# EAGLE schematic monitoring_board (EAGLE 9.5.1)

## Sheet 1 of 5
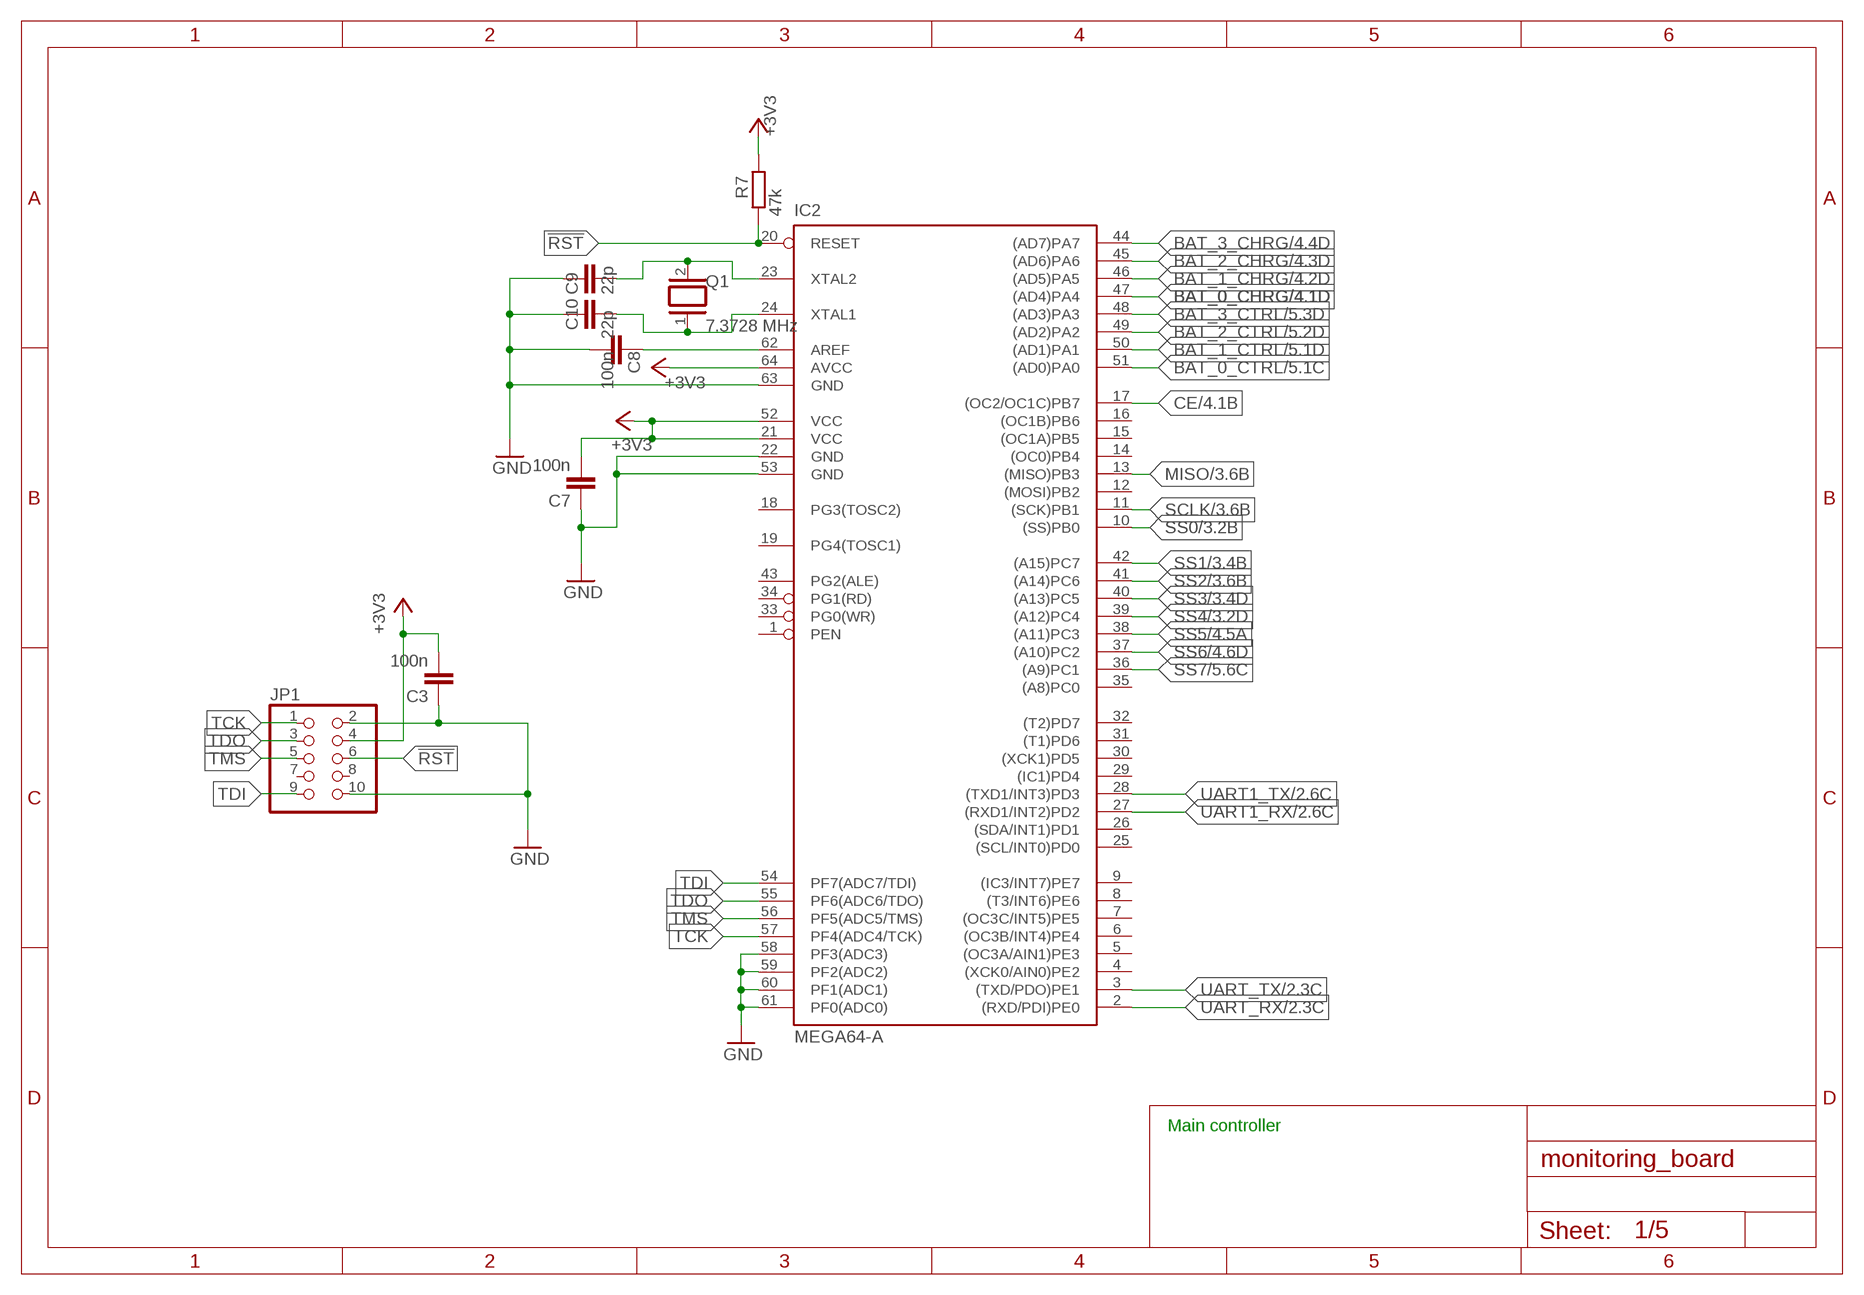
[diagram p0: schematic, sheet 1]

### Parts
C3  100n  C-EUC0603  [C0603]
C7  100n  C-EUC0603  [C0603]
C8  100n  C-EUC0603  [C0603]
C9  22p  C-EUC0603  [C0603]
C10  22p  C-EUC0603  [C0603]
IC2  MEGA64-A  [TQFP64]
JP1  PINHD-2X5  [2X05]
Q1  7.3728 MHz  XTAL/S  [QS]
R7  47k  R-EU_R0603  [R0603]

### Nets
!RST: IC2.20(RESET) JP1.6 R7.1
AREF: C8.1 IC2.62(AREF)
BAT_0_CHRG: IC2.47((AD4)PA4) ; also sheet 4
BAT_0_CTRL: IC2.51((AD0)PA0) ; also sheet 5
BAT_1_CHRG: IC2.46((AD5)PA5) ; also sheet 4
BAT_1_CTRL: IC2.50((AD1)PA1) ; also sheet 5
BAT_2_CHRG: IC2.45((AD6)PA6) ; also sheet 4
BAT_2_CTRL: IC2.49((AD2)PA2) ; also sheet 5
BAT_3_CHRG: IC2.44((AD7)PA7) ; also sheet 4
BAT_3_CTRL: IC2.48((AD3)PA3) ; also sheet 5
CE: IC2.17((OC2/OC1C)PB7) ; also sheet 4
GND: C3.1 C7.1 C8.2 C9.1 C10.1 IC2.22(GND) IC2.53(GND) IC2.58(PF3(ADC3)) IC2.59(PF2(ADC2)) IC2.60(PF1(ADC1)) IC2.61(PF0(ADC0)) IC2.63(GND) JP1.2 JP1.10 ; also sheet 2,3,4,5
MISO: IC2.13((MISO)PB3) ; also sheet 3,4,5
N$12: C9.2 IC2.23(XTAL2) Q1.2
N$13: C10.2 IC2.24(XTAL1) Q1.1
SCLK: IC2.11((SCK)PB1) ; also sheet 3,4,5
SS0: IC2.10((SS)PB0) ; also sheet 3
SS1: IC2.42((A15)PC7) ; also sheet 3
SS2: IC2.41((A14)PC6) ; also sheet 3
SS3: IC2.40((A13)PC5) ; also sheet 3
SS4: IC2.39((A12)PC4) ; also sheet 3
SS5: IC2.38((A11)PC3) ; also sheet 4
SS6: IC2.37((A10)PC2) ; also sheet 4
SS7: IC2.36((A9)PC1) ; also sheet 5
TCK: IC2.57(PF4(ADC4/TCK)) JP1.1
TDI: IC2.54(PF7(ADC7/TDI)) JP1.9
TDO: IC2.55(PF6(ADC6/TDO)) JP1.3
TMS: IC2.56(PF5(ADC5/TMS)) JP1.5
UART1_RX: IC2.27((RXD1/INT2)PD2) ; also sheet 2
UART1_TX: IC2.28((TXD1/INT3)PD3) ; also sheet 2
UART_RX: IC2.2((RXD/PDI)PE0) ; also sheet 2
UART_TX: IC2.3((TXD/PDO)PE1) ; also sheet 2
VCC3V3: C3.2 C7.2 IC2.21(VCC) IC2.52(VCC) IC2.64(AVCC) JP1.4 R7.2 ; supply symbol labelled +3V3 ; also sheet 2,3,4,5
Unconnected: IC2.1(PEN) IC2.4((XCK0/AIN0)PE2) IC2.5((OC3A/AIN1)PE3) IC2.6((OC3B/INT4)PE4) IC2.7((OC3C/INT5)PE5) IC2.8((T3/INT6)PE6) IC2.9((IC3/INT7)PE7) IC2.12((MOSI)PB2) IC2.14((OC0)PB4) IC2.15((OC1A)PB5) IC2.16((OC1B)PB6) IC2.18(PG3(TOSC2)) IC2.19(PG4(TOSC1)) IC2.25((SCL/INT0)PD0) IC2.26((SDA/INT1)PD1) IC2.29((IC1)PD4) IC2.30((XCK1)PD5) IC2.31((T1)PD6) IC2.32((T2)PD7) IC2.33(PG0(WR)) IC2.34(PG1(RD)) IC2.35((A8)PC0) IC2.43(PG2(ALE)) JP1.7 JP1.8

### Notes on the sheet
- Main controller

## Sheet 2 of 5
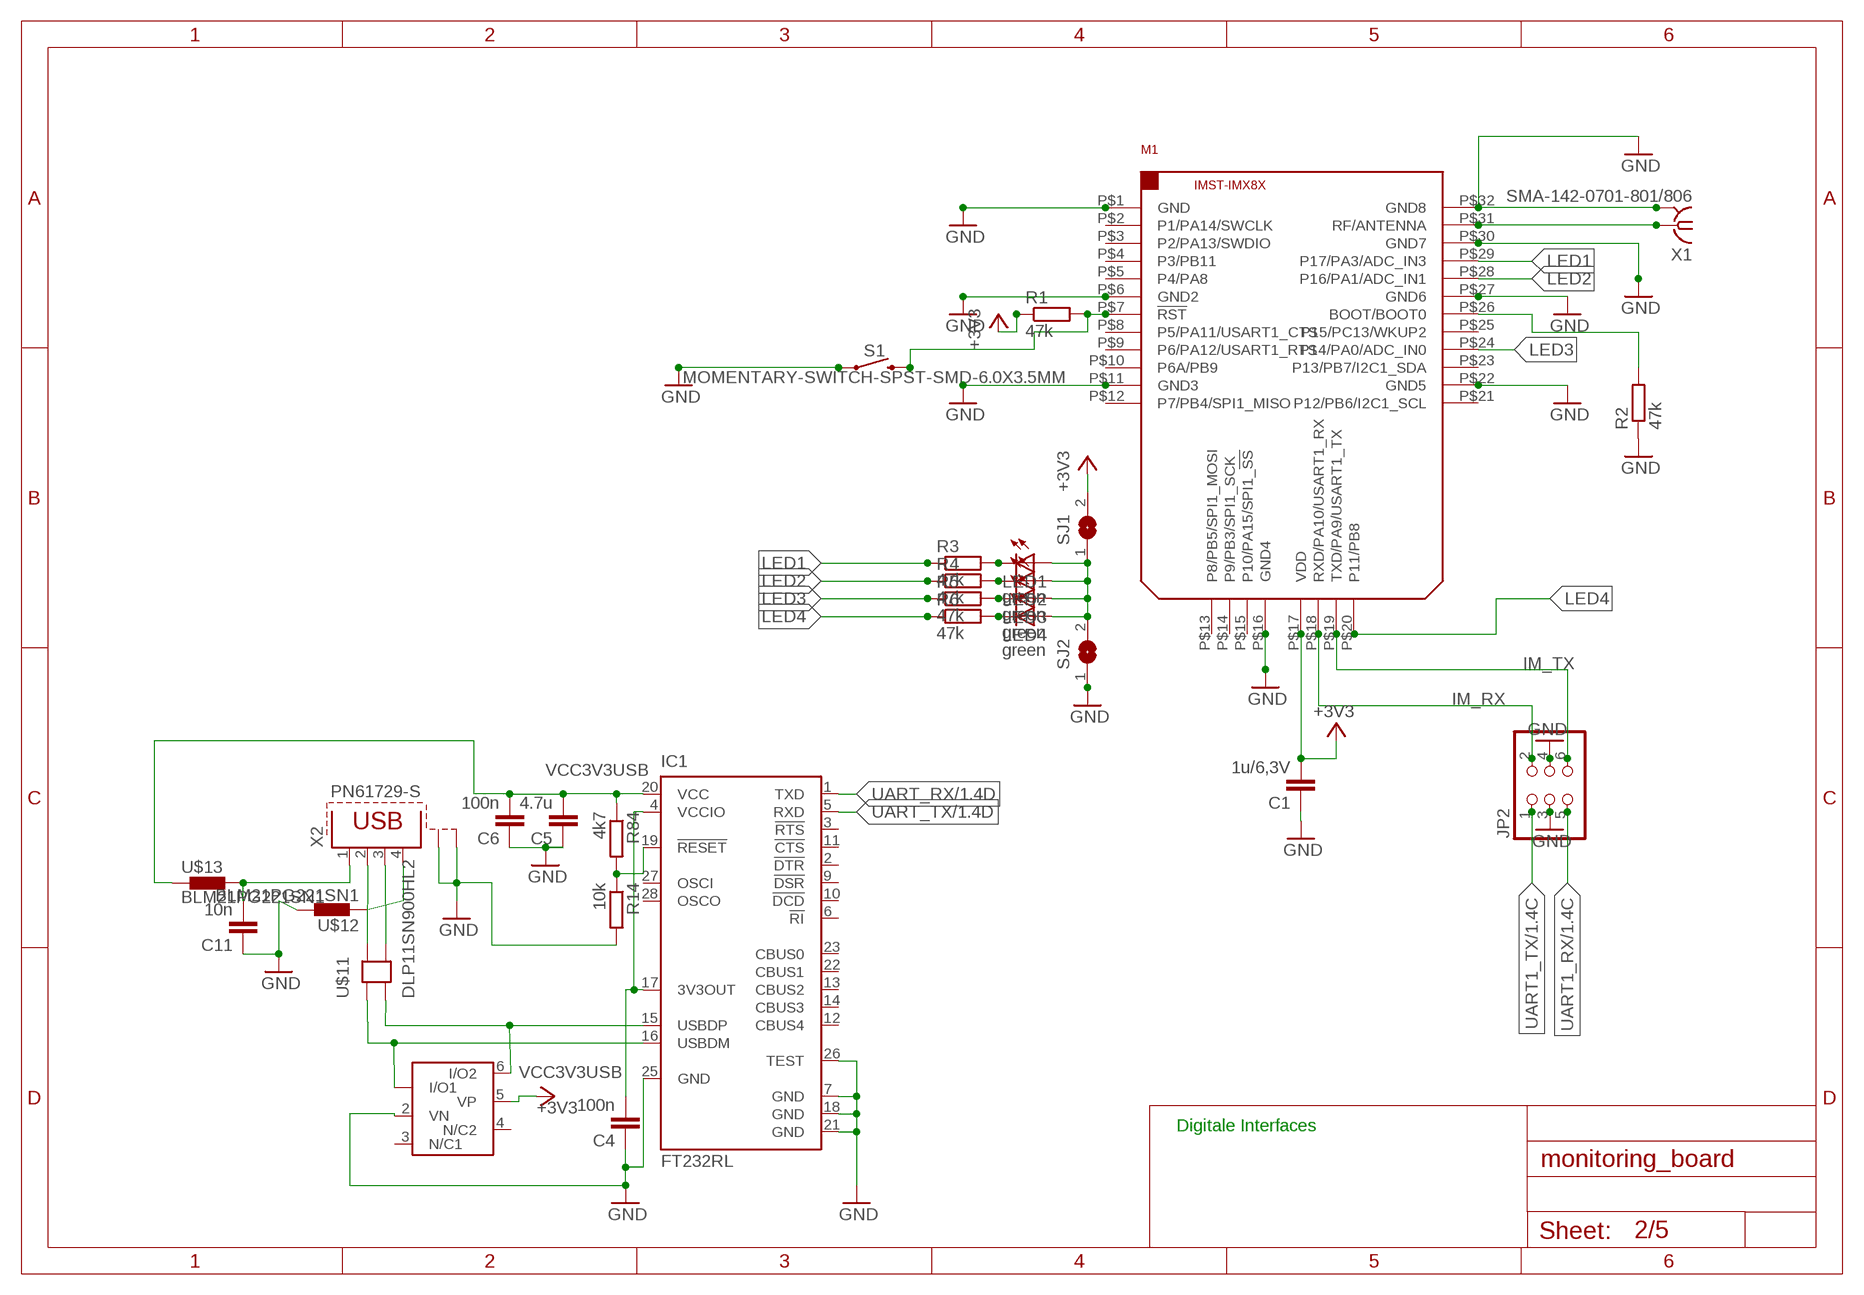
[diagram p1: schematic, sheet 2]
FRAME1 (A4L-LOC): SPICEPREFIX: X

### Parts
C1  1u/6,3V  C-EUC0603  [C0603]
C4  100n  C-EUC0603  [C0603]
C5  4.7u  C-EUC0603  [C0603]
C6  100n  C-EUC0603  [C0603]
C11  10n  C-EUC0603  [C0603]
IC1  FT232RL  [SSOP28]
JP2  PINHD-2X3  [2X03]
LED1  green  LEDCHIP-LED0603  [CHIP-LED0603]
LED2  green  LEDCHIP-LED0603  [CHIP-LED0603]
LED3  green  LEDCHIP-LED0603  [CHIP-LED0603]
LED4  green  LEDCHIP-LED0603  [CHIP-LED0603]
M1  IM-X8X  [IM-X8X]
R1  47k  R-EU_R0603  [R0603]
R2  47k  R-EU_R0603  [R0603]
R3  47k  R-EU_R0603  [R0603]
R4  47k  R-EU_R0603  [R0603]
R5  47k  R-EU_R0603  [R0603]
R6  47k  R-EU_R0603  [R0603]
R14  10k  R-EU_R0603  [R0603]
R84  4k7  R-EU_R0603  [R0603]
S1  MOMENTARY-SWITCH-SPST-SMD-6.0X3.5MM  [TACTILE_SWITCH_SMD_6.0X3.5MM]
SJ1  SJ  [SJ]
SJ2  SJ  [SJ]
U$11  DLP11SN900HL2  [DLP11SN900HL2]
U$12  BLM21PG221SN1  [BLM21PG221SN1]
U$13  BLM21PG221SN1  [BLM21PG221SN1]
U$14  DUP2201MR6  [NUP2201MR6]
X1  SMA-142-0701-801/806  [J502-ND-142-0701-801/806]
X2  PN61729-S  [PN61729-S]

### Nets
3V3OUT: C4.2 IC1.4(VCCIO) IC1.17(3V3OUT)
GND: C1.1 C4.1 C5.1 C6.1 C11.1 IC1.7(GND) IC1.18(GND) IC1.21(GND) IC1.25(GND) IC1.26(TEST) JP2.3 JP2.4 M1.P$1(GND) M1.P$6(GND2) M1.P$11(GND3) M1.P$16(GND4) M1.P$22(GND5) M1.P$27(GND6) M1.P$30(GND7) M1.P$32(GND8) R2.1 R14.2 S1.1 SJ2.1 U$12.2 U$14.2(VN) X1.G@1 X1.G@2 X1.G@3 X1.G@4 X2.S1 X2.S2 ; also sheet 1,3,4,5
IM_RX: JP2.2 M1.P$18(RXD/PA10/USART1_RX)
IM_TX: JP2.6 M1.P$19(TXD/PA9/USART1_TX)
LED1: M1.P$29(P17/PA3/ADC_IN3) R3.1
LED2: M1.P$28(P16/PA1/ADC_IN1) R4.1
LED3: M1.P$24(P14/PA0/ADC_IN0) R5.1
LED4: M1.P$20(P11/PB8) R6.1
N$1 [ant]: M1.P$31(RF/ANTENNA) X1.1
N$2: LED1.C R3.2
N$3: M1.P$7(!RST) R1.2 S1.2
N$4: M1.P$26(BOOT/BOOT0) R2.2
N$5: LED2.C R4.2
N$6: LED3.C R5.2
N$7: LED4.C R6.2
N$8: IC1.19(!RESET) R14.1 R84.2
N$9: LED1.A LED2.A LED3.A LED4.A SJ1.1 SJ2.2
N$17: U$11.2 X2.2
N$18: U$11.4 X2.3
N$19: IC1.16(USBDM) U$11.1 U$14.1(I/O1)
N$20: IC1.15(USBDP) U$11.3 U$14.6(I/O2)
N$21: U$12.1 X2.4
N$30: C11.2 U$13.2 X2.1
UART1_RX: JP2.5 ; also sheet 1
UART1_TX: JP2.1 ; also sheet 1
UART_RX: IC1.1(TXD) ; also sheet 1
UART_TX: IC1.5(RXD) ; also sheet 1
VCC3V3: C1.2 M1.P$17(VDD) R1.1 SJ1.2 ; supply symbol labelled +3V3 ; also sheet 1,3,4,5
VCC3V3USB: C5.2 C6.2 IC1.20(VCC) R84.1 U$13.1 U$14.5(VP) ; supply symbol labelled +3V3
Unconnected: IC1.2(!DTR) IC1.3(!RTS) IC1.6(!RI) IC1.9(!DSR) IC1.10(!DCD) IC1.11(!CTS) IC1.12(CBUS4) IC1.13(CBUS2) IC1.14(CBUS3) IC1.22(CBUS1) IC1.23(CBUS0) IC1.27(OSCI) IC1.28(OSCO) M1.P$2(P1/PA14/SWCLK) M1.P$3(P2/PA13/SWDIO) M1.P$4(P3/PB11) M1.P$5(P4/PA8) M1.P$8(P5/PA11/USART1_CTS) M1.P$9(P6/PA12/USART1_RTS) M1.P$10(P6A/PB9) M1.P$12(P7/PB4/SPI1_MISO) M1.P$13(P8/PB5/SPI1_MOSI) M1.P$14(P9/PB3/SPI1_SCK) M1.P$15(P10/PA15/SPI1_!SS) M1.P$21(P12/PB6/I2C1_SCL) M1.P$23(P13/PB7/I2C1_SDA) M1.P$25(P15/PC13/WKUP2) U$14.3(N/C1) U$14.4(N/C2)

### Notes on the sheet
- Digitale Interfaces

## Sheet 3 of 5
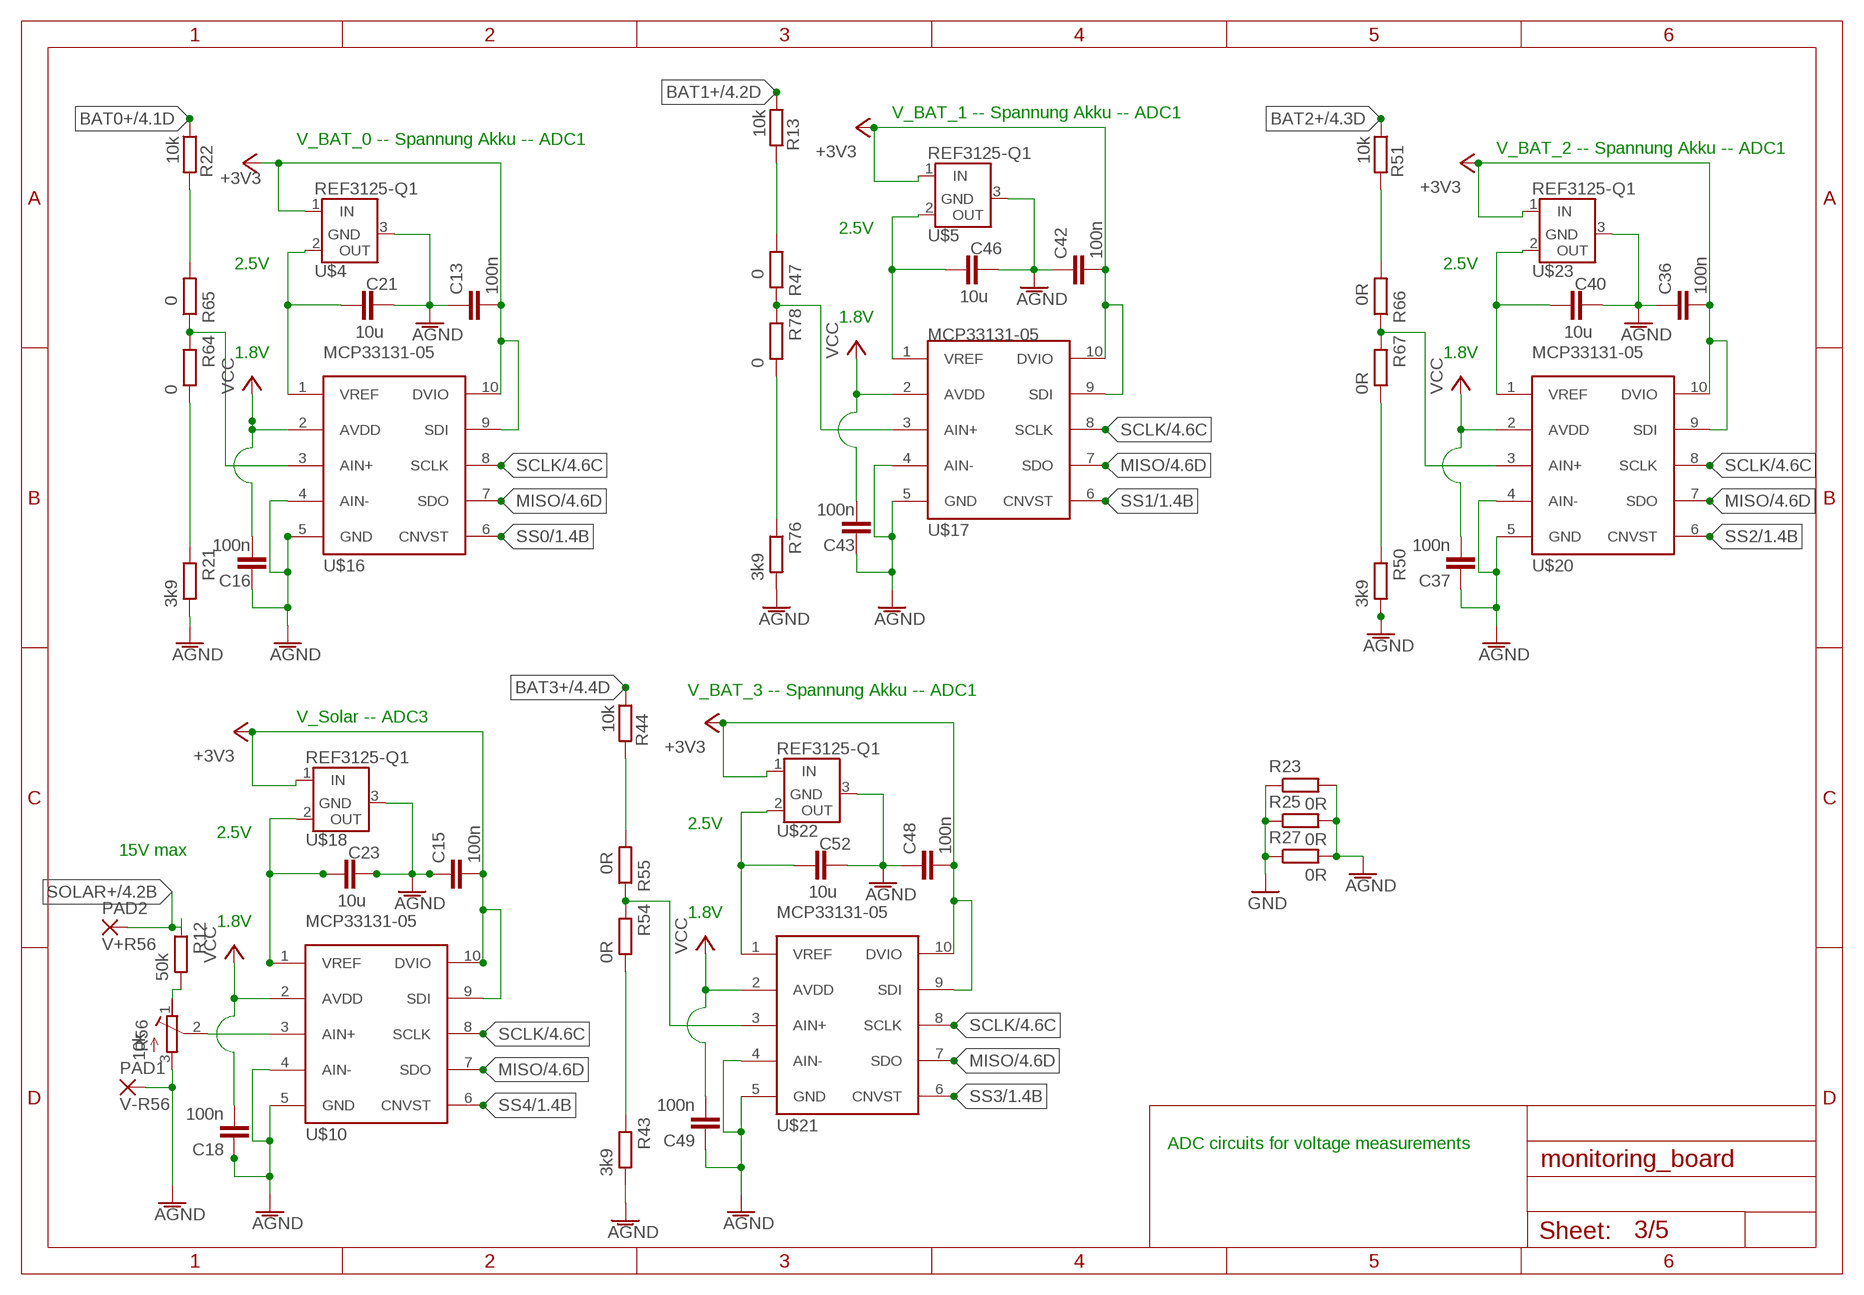
[diagram p2: schematic, sheet 3]

### Parts
C13  100n  C-EUC0603  [C0603]
C15  100n  C-EUC0603  [C0603]
C16  100n  C-EUC0603  [C0603]
C18  100n  C-EUC0603  [C0603]
C21  10u  C-EUC0603  [C0603]
C23  10u  C-EUC0603  [C0603]
C36  100n  C-EUC0603  [C0603]
C37  100n  C-EUC0603  [C0603]
C40  10u  C-EUC0603  [C0603]
C42  100n  C-EUC0603  [C0603]
C43  100n  C-EUC0603  [C0603]
C46  10u  C-EUC0603  [C0603]
C48  100n  C-EUC0603  [C0603]
C49  100n  C-EUC0603  [C0603]
C52  10u  C-EUC0603  [C0603]
PAD1  V-R56  SMD2  [SMD1,27-2,54]
PAD2  V+R56  SMD2  [SMD1,27-2,54]
R12  50k  R-EU_R0603  [R0603]
R13  10k  R-EU_R0603  [R0603]
R21  3k9  R-EU_R0603  [R0603]
R22  10k  R-EU_R0603  [R0603]
R23  0R  R-EU_R0603  [R0603]
R25  0R  R-EU_R0603  [R0603]
R27  0R  R-EU_R0603  [R0603]
R43  3k9  R-EU_R0603  [R0603]
R44  10k  R-EU_R0603  [R0603]
R47  0  R-EU_R0603  [R0603]
R50  3k9  R-EU_R0603  [R0603]
R51  10k  R-EU_R0603  [R0603]
R54  0R  R-EU_R0603  [R0603]
R55  0R  R-EU_R0603  [R0603]
R56  10k  R-TRIMM  [RTRIMCA6]
R64  0  R-EU_R0603  [R0603]
R65  0  R-EU_R0603  [R0603]
R66  0R  R-EU_R0603  [R0603]
R67  0R  R-EU_R0603  [R0603]
R76  3k9  R-EU_R0603  [R0603]
R78  0  R-EU_R0603  [R0603]
U$4  REF3125-Q1  REF31XX-Q1  [REF31XX-Q1]
U$5  REF3125-Q1  REF31XX-Q1  [REF31XX-Q1]
U$10  MCP33131-05  [MCP33131-05]
U$16  MCP33131-05  [MCP33131-05]
U$17  MCP33131-05  [MCP33131-05]
U$18  REF3125-Q1  REF31XX-Q1  [REF31XX-Q1]
U$20  MCP33131-05  [MCP33131-05]
U$21  MCP33131-05  [MCP33131-05]
U$22  REF3125-Q1  REF31XX-Q1  [REF31XX-Q1]
U$23  REF3125-Q1  REF31XX-Q1  [REF31XX-Q1]

### Nets
AGND: C13.1 C15.1 C16.1 C18.1 C21.2 C23.2 C36.1 C37.1 C40.2 C42.1 C43.1 C46.2 C48.1 C49.1 C52.2 PAD1.1(P) R21.2 R23.2 R25.2 R27.2 R43.2 R50.2 R56.3(A) R76.2 U$4.3(GND) U$5.3(GND) U$10.4(AIN-) U$10.5(GND) U$16.4(AIN-) U$16.5(GND) U$17.4(AIN-) U$17.5(GND) U$18.3(GND) U$20.4(AIN-) U$20.5(GND) U$21.4(AIN-) U$21.5(GND) U$22.3(GND) U$23.3(GND) ; also sheet 4,5
BAT0+: R22.1 ; also sheet 4,5
BAT1+: R13.1 ; also sheet 4,5
BAT2+: R51.1 ; also sheet 4,5
BAT3+: R44.1 ; also sheet 4,5
GND: R23.1 R25.1 R27.1 ; also sheet 1,2,4,5
MISO: U$10.7(SDO) U$16.7(SDO) U$17.7(SDO) U$20.7(SDO) U$21.7(SDO) ; also sheet 1,4,5
N$10: R12.2 R56.1(E)
N$22: R51.2 R66.2
N$23: C23.1 U$10.1(VREF) U$18.2(OUT)
N$24: C21.1 U$4.2(OUT) U$16.1(VREF)
N$26: R56.2(S) U$10.3(AIN+)
N$38: R22.2 R65.2
N$39: R21.1 R64.2
N$41: R13.2 R47.2
N$42: R76.1 R78.2
N$43: R50.1 R67.2
N$44: R44.2 R55.2
N$48: R43.1 R54.2
N$57: C40.1 U$20.1(VREF) U$23.2(OUT)
N$68: R64.1 R65.1 U$16.3(AIN+)
N$78: R66.1 R67.1 U$20.3(AIN+)
N$86: C46.1 U$5.2(OUT) U$17.1(VREF)
N$91: R47.1 R78.1 U$17.3(AIN+)
N$92: R54.1 R55.1 U$21.3(AIN+)
N$99: C52.1 U$21.1(VREF) U$22.2(OUT)
SCLK: U$10.8(SCLK) U$16.8(SCLK) U$17.8(SCLK) U$20.8(SCLK) U$21.8(SCLK) ; also sheet 1,4,5
SOLAR+: PAD2.1(P) R12.1 ; also sheet 4
SS0: U$16.6(CNVST) ; also sheet 1
SS1: U$17.6(CNVST) ; also sheet 1
SS2: U$20.6(CNVST) ; also sheet 1
SS3: U$21.6(CNVST) ; also sheet 1
SS4: U$10.6(CNVST) ; also sheet 1
VCC1V8: C16.2 C18.2 C37.2 C43.2 C49.2 U$10.2(AVDD) U$16.2(AVDD) U$17.2(AVDD) U$20.2(AVDD) U$21.2(AVDD) ; supply symbol labelled VCC ; also sheet 4,5
VCC3V3: C13.2 C15.2 C36.2 C42.2 C48.2 U$4.1(IN) U$5.1(IN) U$10.9(SDI) U$10.10(DVIO) U$16.9(SDI) U$16.10(DVIO) U$17.9(SDI) U$17.10(DVIO) U$18.1(IN) U$20.9(SDI) U$20.10(DVIO) U$21.9(SDI) U$21.10(DVIO) U$22.1(IN) U$23.1(IN) ; supply symbol labelled +3V3 ; also sheet 1,2,4,5

### Notes on the sheet
- V_BAT_1 -- Spannung Akku -- ADC1
- V_BAT_0 -- Spannung Akku -- ADC1
- V_BAT_2 -- Spannung Akku -- ADC1
- 2.5V
- 2.5V | 2.5V
- 1.8V
- 1.8V | 1.8V
- V_BAT_3 -- Spannung Akku -- ADC1
- V_Solar -- ADC3
- 2.5V
- 2.5V
- 15V max
- 1.8V
- 1.8V
- ADC circuits for voltage measurements

## Sheet 4 of 5
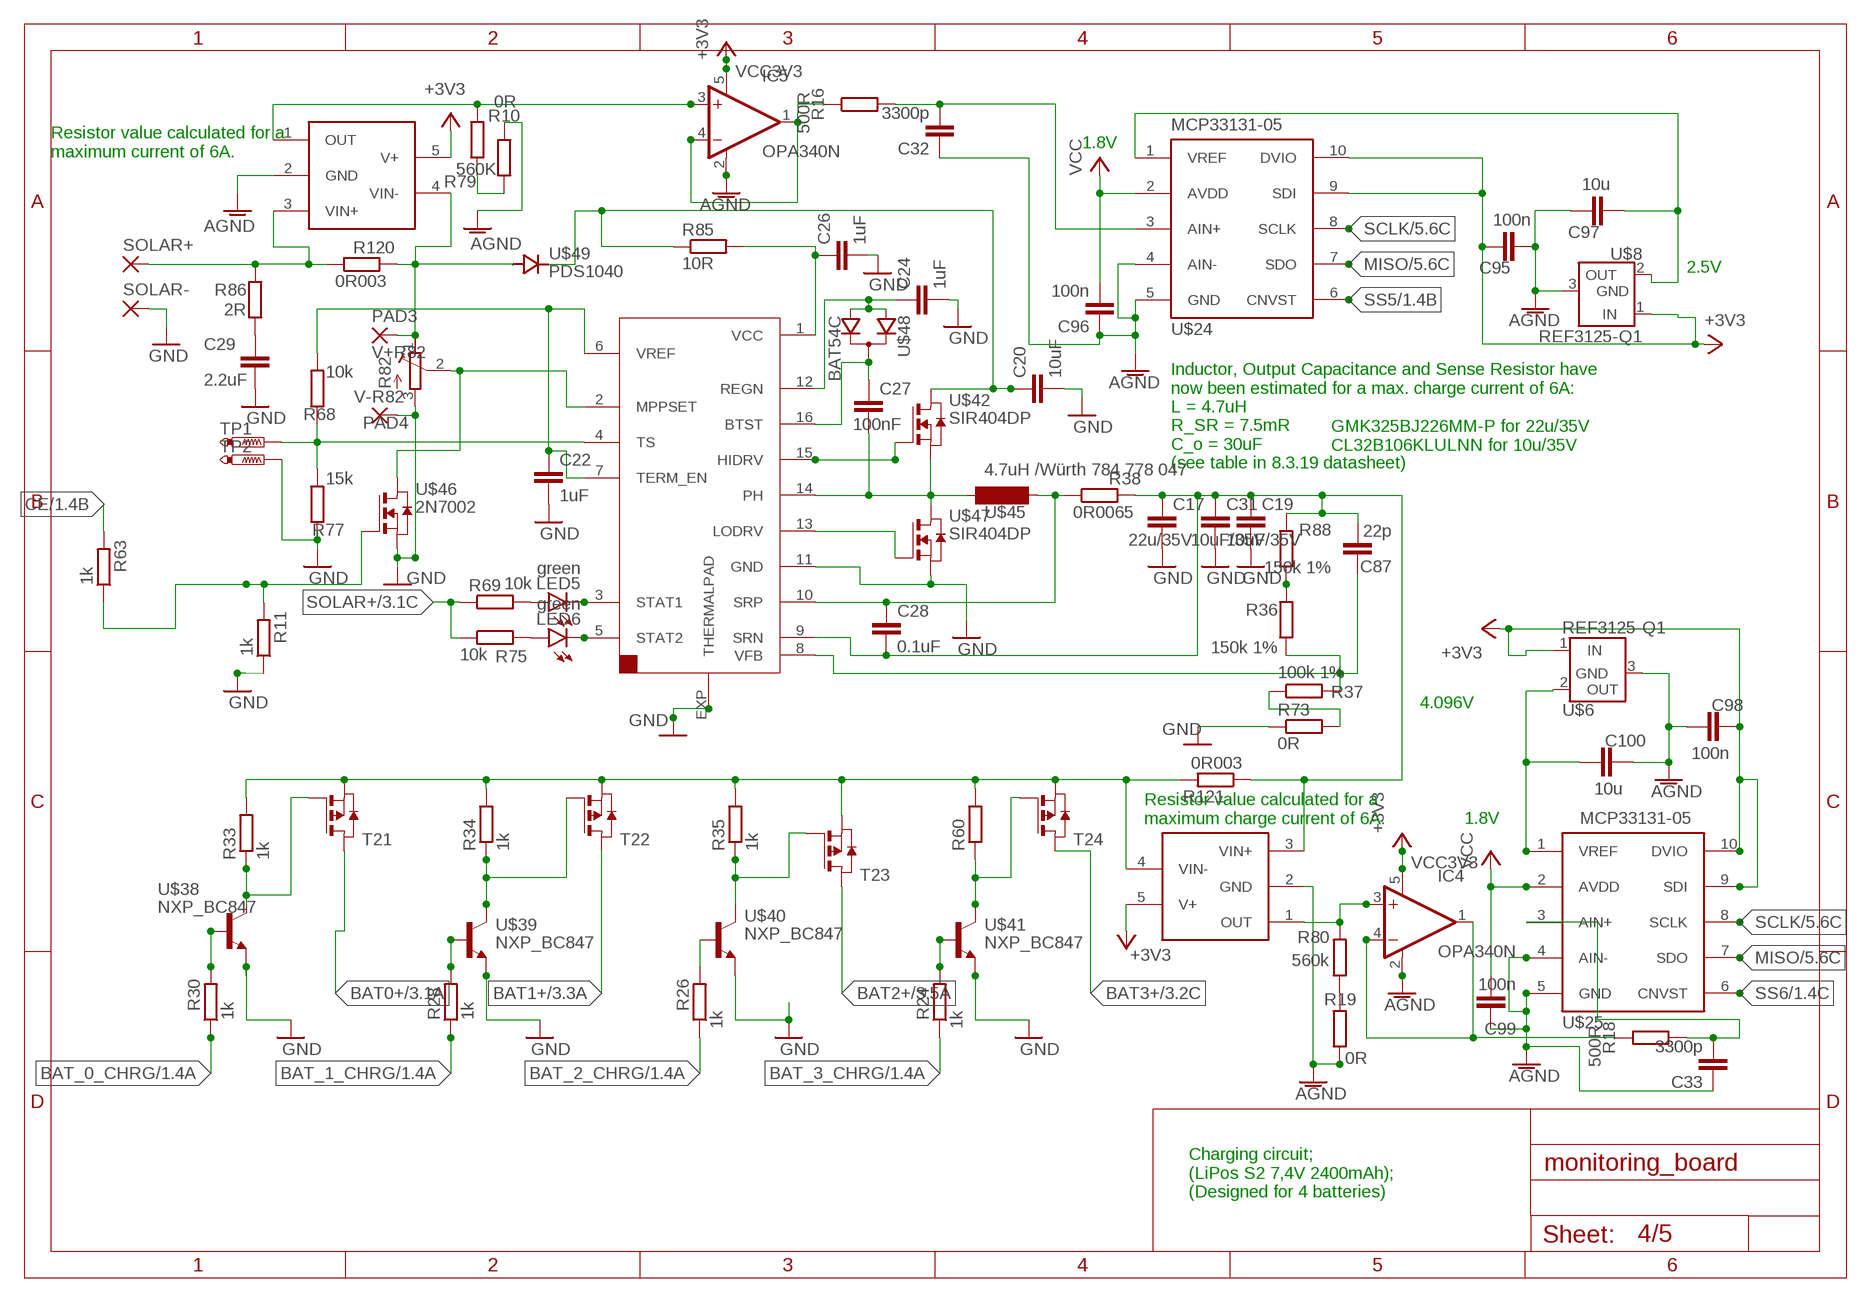
[diagram p3: schematic, sheet 4]

### Parts
C17  22u/35V  C-EUC1210  [C1210]
C19  10uF/35V  C-EUC1210  [C1210]
C20  10uF  C-EUC1210  [C1210]
C22  1uF  C-EUC0805  [C0805]
C24  1uF  C-EUC0805  [C0805]
C26  1uF  C-EUC0805  [C0805]
C27  100nF  C-EUC0805  [C0805]
C28  0.1uF  C-EUC0603K  [C0603K]
C29  2.2uF  C-EUC0805  [C0805]
C31  10uF/35V  C-EUC1210  [C1210]
C32  3300p  C-EUC0603  [C0603]
C33  3300p  C-EUC0603  [C0603]
C87  22p  C-EUC0603  [C0603]
C95  100n  C-EUC0603  [C0603]
C96  100n  C-EUC0603  [C0603]
C97  10u  C-EUC0603  [C0603]
C98  100n  C-EUC0603  [C0603]
C99  100n  C-EUC0603  [C0603]
C100  10u  C-EUC0603  [C0603]
IC4  OPA340N  [SOT23-5]
IC5  OPA340N  [SOT23-5]
LED5  green  LEDCHIPLED_0603  [CHIPLED_0603]
LED6  green  LEDCHIPLED_0603  [CHIPLED_0603]
PAD3  V+R82  SMD2  [SMD1,27-2,54]
PAD4  V-R82  SMD2  [SMD1,27-2,54]
R10  0R  R-EU_R0603  [R0603]
R11  1k  R-EU_R0603  [R0603]
R16  500R  R-EU_R0603  [R0603]
R18  500R  R-EU_R0603  [R0603]
R19  0R  R-EU_R0603  [R0603]
R24  1k  R-EU_R0603  [R0603]
R26  1k  R-EU_R0603  [R0603]
R28  1k  R-EU_R0603  [R0603]
R30  1k  R-EU_R0603  [R0603]
R33  1k  R-EU_R0603  [R0603]
R34  1k  R-EU_R0603  [R0603]
R35  1k  R-EU_R0603  [R0603]
R36  150k 1%  R-EU_R0402  [R0402]
R37  100k 1%  R-EU_R0402  [R0402]
R38  0R0065  R-EU_R2512  [R2512]
R60  1k  R-EU_R0603  [R0603]
R63  1k  R-EU_R0603  [R0603]
R68  10k  R-EU_R0402  [R0402]
R69  10k  R-EU_R0402  [R0402]
R73  0R  R-EU_R0402  [R0402]
R75  10k  R-EU_R0402  [R0402]
R77  15k  R-EU_R0402  [R0402]
R79  560K  R-EU_R0603  [R0603]
R80  560k  R-EU_R0603  [R0603]
R82  R-TRIMM  [RTRIMCA6]
R85  10R  R-EU_R1206  [R1206]
R86  2R  R-EU_R2012  [R2012]
R88  150k 1%  R-EU_R0402  [R0402]
R120  0R003  R-EU_R2512  [R2512]
R121  0R003  R-EU_R2512  [R2512]
SOLAR+  SMDPAD  [SMDPAD]
SOLAR-  SMDPAD  [SMDPAD]
T21  SI7157DP  [SI7157DP]
T22  SI7157DP  [SI7157DP]
T23  SI7157DP  [SI7157DP]
T24  SI7157DP  [SI7157DP]
TP1  PTR1PAD1-13  [P1-13]
TP2  PTR1PAD1-13  [P1-13]
U$6  REF3125-Q1  REF31XX-Q1  [REF31XX-Q1]
U$8  REF3125-Q1  REF31XX-Q1  [REF31XX-Q1]
U$24  MCP33131-05  [MCP33131-05]
U$25  MCP33131-05  [MCP33131-05]
U$27  INA138  [INA138]
U$28  INA138  [INA138]
U$36  BQ24650  [BQ24650]
U$38  NXP_BC847  [NXP_BC847]
U$39  NXP_BC847  [NXP_BC847]
U$40  NXP_BC847  [NXP_BC847]
U$41  NXP_BC847  [NXP_BC847]
U$42  SIR404DP  [SIR404DP]
U$45  4.7uH /Würth 784 778 047  IHLP-2525CZ-01  [IHLP-2525CZ-01]
U$46  2N7002  [2N7002]
U$47  SIR404DP  [SIR404DP]
U$48  BAT54C  [BAT54C]
U$49  PDS1040  [PDS1040]

### Nets
AGND: C32.1 C33.1 C95.1 C96.1 C97.2 C98.1 C99.1 C100.2 IC4.2(V-) IC5.2(V-) R10.1 R19.1 U$6.3(GND) U$8.3(GND) U$24.4(AIN-) U$24.5(GND) U$25.4(AIN-) U$25.5(GND) U$27.2(GND) U$28.2(GND) ; also sheet 3,5
AIN+: IC4.3(+IN) R80.2 U$27.1(OUT)
BAT0+: T21.5(D) T21.6(D) T21.7(D) T21.8(D) T21.9(D) ; also sheet 3,5
BAT1+: T22.5(D) T22.6(D) T22.7(D) T22.8(D) T22.9(D) ; also sheet 3,5
BAT2+: T23.5(D) T23.6(D) T23.7(D) T23.8(D) T23.9(D) ; also sheet 3,5
BAT3+: T24.5(D) T24.6(D) T24.7(D) T24.8(D) T24.9(D) ; also sheet 3,5
BAT_0_CHRG: R30.1 ; also sheet 1
BAT_1_CHRG: R28.1 ; also sheet 1
BAT_2_CHRG: R26.1 ; also sheet 1
BAT_3_CHRG: R24.1 ; also sheet 1
BTST: C27.1 U$36.16(BTST) U$48.3(C)
CE: R63.2 ; also sheet 1
GND: C17.2 C19.2 C20.2 C22.2 C24.2 C26.2 C29.2 C31.2 PAD4.1(P) R11.1 R73.1 R77.1 R82.3(A) SOLAR-.1(P) TP2.TP U$36.11(GND) U$36.EXP(THERMALPAD) U$38.2(E) U$39.2(E) U$40.2(E) U$41.2(E) U$46.2(S) U$47.1(S) U$47.2(S) U$47.3(S) ; also sheet 1,2,3,5
HIDRV: U$36.15(HIDRV) U$42.4(G)
LODRV: U$36.13(LODRV) U$47.4(G)
MISO: U$24.7(SDO) U$25.7(SDO) ; also sheet 1,3,5
MPPSET: R82.2(S) U$36.2(MPPSET) U$46.3(D)
N$25: IC4.1(OUT) IC4.4(-IN) R18.1
N$29: IC5.1(OUT) IC5.4(-IN) R16.1
N$34: R33.1 T21.4(G) U$38.3(C)
N$36: C32.2 R16.2 U$24.3(AIN+)
N$37: C33.2 R18.2 U$25.3(AIN+)
N$40: IC5.3(+IN) R79.2 U$28.1(OUT)
N$46: R34.1 T22.4(G) U$39.3(C)
N$47: LED5.A R69.2
N$51: R35.1 T23.4(G) U$40.3(C)
N$52: LED6.A R75.2
N$54: C29.1 R86.1
N$55: R10.2 R79.1
N$59: R60.1 T24.4(G) U$41.3(C)
N$61: R26.2 U$40.1(B)
N$62: R28.2 U$39.1(B)
N$63: R30.2 U$38.1(B)
N$64: R24.2 U$41.1(B)
N$65: R11.2 R63.1 U$46.1(G)
N$83: R36.2 R88.1
N$95: R19.2 R80.1
N$98: C87.1 R36.1 R37.2 U$36.8(VFB)
N$100: R37.1 R73.2
N$114: C26.1 R85.2 U$36.1(VCC)
N$154: C20.1 R85.1 U$42.5(D) U$42.6(D) U$42.7(D) U$42.8(D) U$42.9(D) U$49.P$1(C)
N$173: PAD3.1(P) R82.1(E) R120.2 U$28.4(VIN-) U$49.1(A) U$49.2(A)
N$201: C100.1 U$6.2(OUT) U$25.1(VREF)
N$202: R33.2 R34.2 R35.2 R60.2 R121.2 T21.1(S) T21.2(S) T21.3(S) T22.1(S) T22.2(S) T22.3(S) T23.1(S) T23.2(S) T23.3(S) T24.1(S) T24.2(S) T24.3(S) U$27.4(VIN-)
N$204: C97.1 U$8.2(OUT) U$24.1(VREF)
PH: C27.2 U$36.14(PH) U$42.1(S) U$42.2(S) U$42.3(S) U$45.1 U$47.5(D) U$47.6(D) U$47.7(D) U$47.8(D) U$47.9(D)
REGN: C24.1 U$36.12(REGN) U$48.1(A1) U$48.2(A2)
SCLK: U$24.8(SCLK) U$25.8(SCLK) ; also sheet 1,3,5
SOLAR+: R69.1 R75.1 R86.2 R120.1 SOLAR+.1(P) U$28.3(VIN+) ; also sheet 3
SRN: C17.1 C19.1 C28.2 C31.1 C87.2 R38.2 R88.2 R121.1 U$27.3(VIN+) U$36.9(SRN)
SRP: C28.1 R38.1 U$36.10(SRP) U$45.2
SS5: U$24.6(CNVST) ; also sheet 1
SS6: U$25.6(CNVST) ; also sheet 1
STAT1: LED5.C U$36.3(STAT1)
STAT2: LED6.C U$36.5(STAT2)
TS: R68.1 R77.2 TP1.TP U$36.4(TS)
VCC1V8: C96.2 C99.2 U$24.2(AVDD) U$25.2(AVDD) ; supply symbol labelled VCC ; also sheet 3,5
VCC3V3: C95.2 C98.2 IC4.5(V+) IC5.5(V+) U$6.1(IN) U$8.1(IN) U$24.9(SDI) U$24.10(DVIO) U$25.9(SDI) U$25.10(DVIO) U$27.5(V+) U$28.5(V+) ; supply symbol labelled +3V3 ; also sheet 1,2,3,5
VREF: C22.1 R68.2 U$36.6(VREF) U$36.7(TERM_EN)

### Notes on the sheet
- 1.8V
- Resistor value calculated for a 
  maximum current of 6A.
- 2.5V
- GMK325BJ226MM-P for 22u/35V
  CL32B106KLULNN for 10u/35V
- Inductor, Output Capacitance and Sense Resistor have
  now been estimated for a max. charge current of 6A:
  L = 4.7uH
  R_SR = 7.5mR
  C_o = 30uF
  (see table in 8.3.19 datasheet)
- 4.096V
- Resistor value calculated for a 
  maximum charge current of 6A.
- 1.8V
- Charging circuit;
  (LiPos S2 7,4V 2400mAh);
  (Designed for 4 batteries)

## Sheet 5 of 5
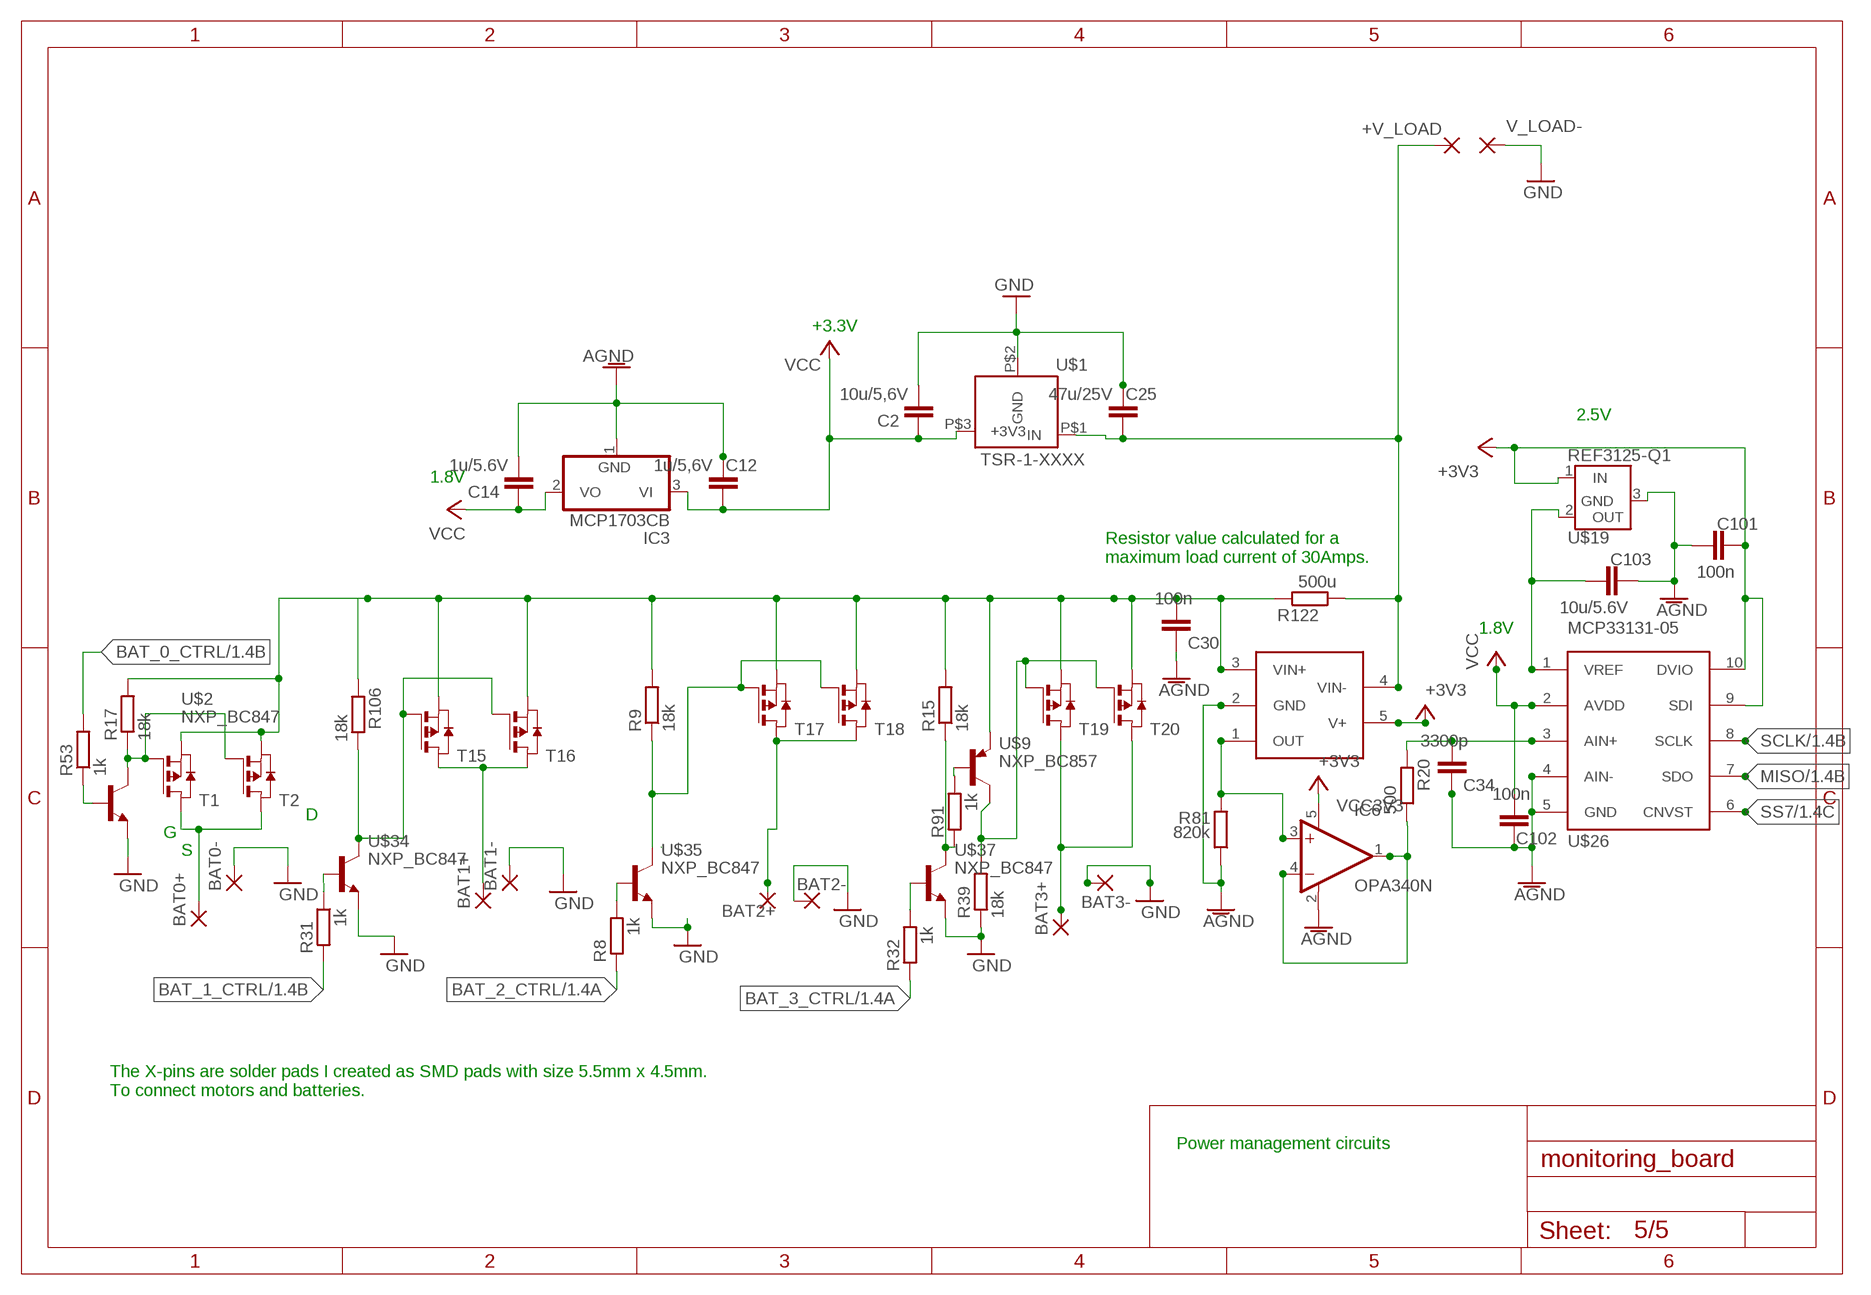
[diagram p4: schematic, sheet 5]

### Parts
+V_LOAD  SMDPAD  [SMDPAD]
BAT0+  SMDPAD  [SMDPAD]
BAT0-  SMDPAD  [SMDPAD]
BAT1+  SMDPAD  [SMDPAD]
BAT1-  SMDPAD  [SMDPAD]
BAT2+  SMDPAD  [SMDPAD]
BAT2-  SMDPAD  [SMDPAD]
BAT3+  SMDPAD  [SMDPAD]
BAT3-  SMDPAD  [SMDPAD]
C2  10u/5,6V  C-EUC1206  [C1206]
C12  1u/5,6V  C-EUC1206  [C1206]
C14  1u/5.6V  C-EUC1206  [C1206]
C25  47u/25V  C-EUC1206  [C1206]
C30  100n  C-EUC0603  [C0603]
C34  3300p  C-EUC0603  [C0603]
C101  100n  C-EUC0603  [C0603]
C102  100n  C-EUC0603  [C0603]
C103  10u/5.6V  C-EUC0603  [C0603]
IC3  MCP1703CB  [SOT23]
IC6  OPA340N  [SOT23-5]
R8  1k  R-EU_R0603  [R0603]
R9  18k  R-EU_R0603  [R0603]
R15  18k  R-EU_R0603  [R0603]
R17  18k  R-EU_R0603  [R0603]
R20  500  R-EU_R0603  [R0603]
R31  1k  R-EU_R0603  [R0603]
R32  1k  R-EU_R0603  [R0603]
R39  18k  R-EU_R0603  [R0603]
R53  1k  R-EU_R0603  [R0603]
R81  820k  R-EU_R0603  [R0603]
R91  1k  R-EU_R0603  [R0603]
R106  18k  R-EU_R0603  [R0603]
R122  500u  R-EU_R2512  [R2512]
T1  SI7157DP  [SI7157DP]
T2  SI7157DP  [SI7157DP]
T15  SI7157DP  [SI7157DP]
T16  SI7157DP  [SI7157DP]
T17  SI7157DP  [SI7157DP]
T18  SI7157DP  [SI7157DP]
T19  SI7157DP  [SI7157DP]
T20  SI7157DP  [SI7157DP]
U$1  TSR-1-XXXX  [TSR-1-XXXX]
U$2  NXP_BC847  [NXP_BC847]
U$9  NXP_BC857  [NXP_BC857]
U$19  REF3125-Q1  REF31XX-Q1  [REF31XX-Q1]
U$26  MCP33131-05  [MCP33131-05]
U$29  INA138  [INA138]
U$34  NXP_BC847  [NXP_BC847]
U$35  NXP_BC847  [NXP_BC847]
U$37  NXP_BC847  [NXP_BC847]
V_LOAD-  SMDPAD  [SMDPAD]

### Nets
+V_LOAD: +V_LOAD.1(P) C25.1 R122.1 U$1.P$1(IN) U$29.4(VIN-)
-V_LOAD: C30.2 R9.2 R15.2 R17.2 R106.2 R122.2 T1.1(S) T1.2(S) T1.3(S) T2.1(S) T2.2(S) T2.3(S) T15.1(S) T15.2(S) T15.3(S) T16.1(S) T16.2(S) T16.3(S) T17.1(S) T17.2(S) T17.3(S) T18.1(S) T18.2(S) T18.3(S) T19.1(S) T19.2(S) T19.3(S) T20.1(S) T20.2(S) T20.3(S) U$9.2(E) U$29.3(VIN+)
AGND: C12.2 C14.2 C30.1 C34.1 C101.1 C102.1 C103.2 IC3.1(GND) IC6.2(V-) R81.1 U$19.3(GND) U$26.4(AIN-) U$26.5(GND) U$29.2(GND) ; also sheet 3,4
BAT0+: BAT0+.1(P) T1.5(D) T1.6(D) T1.7(D) T1.8(D) T1.9(D) T2.5(D) T2.6(D) T2.7(D) T2.8(D) T2.9(D) ; also sheet 3,4
BAT1+: BAT1+.1(P) T15.5(D) T15.6(D) T15.7(D) T15.8(D) T15.9(D) T16.5(D) T16.6(D) T16.7(D) T16.8(D) T16.9(D) ; also sheet 3,4
BAT2+: BAT2+.1(P) T17.5(D) T17.6(D) T17.7(D) T17.8(D) T17.9(D) T18.5(D) T18.6(D) T18.7(D) T18.8(D) T18.9(D) ; also sheet 3,4
BAT3+: BAT3+.1(P) T19.5(D) T19.6(D) T19.7(D) T19.8(D) T19.9(D) T20.5(D) T20.6(D) T20.7(D) T20.8(D) T20.9(D) ; also sheet 3,4
BAT_0_CTRL: R53.2 ; also sheet 1
BAT_1_CTRL: R31.2 ; also sheet 1
BAT_2_CTRL: R8.2 ; also sheet 1
BAT_3_CTRL: R32.2 ; also sheet 1
GND: BAT0-.1(P) BAT1-.1(P) BAT2-.1(P) BAT3-.1(P) C2.2 C25.2 R39.1 U$1.P$2(GND) U$2.2(E) U$34.2(E) U$35.2(E) U$37.2(E) V_LOAD-.1(P) ; also sheet 1,2,3,4
MISO: U$26.7(SDO) ; also sheet 1,3,4
N$11: R106.1 T15.4(G) T16.4(G) U$34.3(C)
N$14: R9.1 T17.4(G) T18.4(G) U$35.3(C)
N$15: R91.1 U$9.1(B)
N$16: R8.1 U$35.1(B)
N$27: IC6.3(+IN) R81.2 U$29.1(OUT)
N$28: R32.1 U$37.1(B)
N$31: R17.1 T1.4(G) T2.4(G) U$2.3(C)
N$32: IC6.1(OUT) IC6.4(-IN) R20.1
N$33: R53.1 U$2.1(B)
N$35: R31.1 U$34.1(B)
N$49: R39.2 T19.4(G) T20.4(G) U$9.3(C)
N$50: C34.2 R20.2 U$26.3(AIN+)
N$72: R15.1 R91.2 U$37.3(C)
N$207: C103.1 U$19.2(OUT) U$26.1(VREF)
SCLK: U$26.8(SCLK) ; also sheet 1,3,4
SS7: U$26.6(CNVST) ; also sheet 1
VCC1V8: C14.1 C102.2 IC3.2(VO) U$26.2(AVDD) ; supply symbol labelled VCC ; also sheet 3,4
VCC3V3: C2.1 C12.1 C101.2 IC3.3(VI) IC6.5(V+) U$1.P$3(+3V3) U$19.1(IN) U$26.9(SDI) U$26.10(DVIO) U$29.5(V+) ; supply symbol labelled +3V3, VCC ; also sheet 1,2,3,4

### Notes on the sheet
- +3.3V
- 2.5V
- 1.8V
- Resistor value calculated for a 
  maximum load current of 30Amps.
- 1.8V
- D
- G
- S
- The X-pins are solder pads I created as SMD pads with size 5.5mm x 4.5mm. 
  To connect motors and batteries.
- Power management circuits

## Library data of the parts
+V_LOAD BAT0+ BAT0- BAT1+ BAT1- BAT2+ BAT2- BAT3+ BAT3- SOLAR+ SOLAR- V_LOAD- = monitoring_board:SMDPAD: SMD Solder Pad -- mainly intended for connecting thicker wires for batteries and motors.
C1 C3-C11 C13 C15 C16 C18 C21 C23 C30 C32-C34 C36 C37 C40 C42 C43 C46 C48 C49 C52 C87 C95-C103 = resistor:C-EU: CAPACITOR, European symbol
C2 C12 C14 C17 C19 C20 C22 C24-C29 C31 = rcl:C-EU: CAPACITOR, European symbol; SPICEPREFIX: C
IC1 = ftdichip:FT232R: Source: http://www.ftdichip.com/Documents/DataSheets/DS_FT232R_v104.pdf; MPN: FT232RL; OC_FARNELL: 1146032; OC_NEWARK: 91K9918
IC2 = atmel:MEGA64: MICROCONTROLLER 64 Kbytes FLASH 4 Kbytes SRAM 2 Kbytes EEPROM DUAL USART 8-channel 10 bit ADC Source: avr.lbr; MPN: ATMEGA64-16AU; OC_FARNELL: 9171355; OC_NEWARK: 01M6899
IC3 = linear:MCP1703: 250 mA, 16V, Low Quiescent Current LDO Regulator Source: http://ww1.microchip.com/downloads/en/DeviceDoc/22049b.pdf
IC4-IC6 = burr-brown:OPA340: Rail-to-Rail Operational Amplifiers Single-Supply, MicroAmplifier(TM) Series; MPN: OPA340NA/3KG4; OC_FARNELL: 1234805; OC_NEWARK: 13M5177
JP1 = pinhead:PINHD-2X5: PIN HEADER
JP2 = pinhead:PINHD-2X3: PIN HEADER
LED1 LED3-LED6 = led:LED: LED OSRAM: - CHIPLED LG R971, LG N971, LY N971, LG Q971, LY Q971, LO R971, LY R971 LH N974, LH R974 LS Q976, LO Q976, LY Q976 LO Q996 - Hyper CHIPLED LW Q18S LB Q993, LB Q99A, LB R99A - SideLED LS A670, LO A670, LY A670, LG A670, LP A670 LB A673, LV A673, LT A673, LW A673 LH A674 LY A675 LS A676, LA A676, LO A676, LY A676, LW A676 LS A679, LY A679, LG A679 - Hyper Micro SIDELED® LS Y876, LA Y876, LO Y876, LY Y876 LT Y87S - SmartLED LW L88C, LW L88S LB L89C, LB L89S, LG L890 LS L89K, LO L89K, LY L89K LS L896, LA L896, LO L896, LY L896 - TOPLED LS T670, LO T670, LY T670, LG T670, LP T670 LSG T670, LSP T670, LSY T670, LOP T670, LYG T670 LG T671, LOG T671, LSG T671 LB T673, LV T673, LT T673, LW T673 LH T674 LS T676, LA T676, LO T676, LY T676, LB T676, LH T676, LSB T676, LW T676 LB T67C, LV T67C, LT T67C, LS T67K, LO T67K, LY T67K, LW E67C LS E67B, LA E67B, LO E67B, LY E67B, LB E67C, LV E67C, LT E67C LW T67C LS T679, LY T679, LG T679 LS T770, LO T770, LY T770, LG T770, LP T770 LB T773, LV T773, LT T773, LW T773 LH T774 LS E675, LA E675, LY E675, LS T675 LS T776, LA T776, LO T776, LY T776, LB T776 LHGB T686 LT T68C, LB T68C - Hyper Mini TOPLED® LB M676 - Mini TOPLED Santana® LG M470 LS M47K, LO M47K, LY M47K Source: http://www.osram.convergy.de LUXEON: - LUMILED® LXK2-PW12-R00, LXK2-PW12-S00, LXK2-PW14-U00, LXK2-PW14-V00 LXK2-PM12-R00, LXK2-PM12-S00, LXK2-PM14-U00 LXK2-PE12-Q00, LXK2-PE12-R00, LXK2-PE12-S00, LXK2-PE14-T00, LXK2-PE14-U00 LXK2-PB12-K00, LXK2-PB12-L00, LXK2-PB12-M00, LXK2-PB14-N00, LXK2-PB14-P00, LXK2-PB14-Q00 LXK2-PR12-L00, LXK2-PR12-M00, LXK2-PR14-Q00, LXK2-PR14-R00 LXK2-PD12-Q00, LXK2-PD12-R00, LXK2-PD12-S00 LXK2-PH12-R00, LXK2-PH12-S00 LXK2-PL12-P00, LXK2-PL12-Q00, LXK2-PL12-R00 Source: www.luxeon.com KINGBRIGHT: KA-3528ASYC Source: www.kingbright.com
LED2 = led:LED: LED OSRAM: - CHIPLED LG R971, LG N971, LY N971, LG Q971, LY Q971, LO R971, LY R971 LH N974, LH R974 LS Q976, LO Q976, LY Q976 LO Q996 - Hyper CHIPLED LW Q18S LB Q993, LB Q99A, LB R99A - SideLED LS A670, LO A670, LY A670, LG A670, LP A670 LB A673, LV A673, LT A673, LW A673 LH A674 LY A675 LS A676, LA A676, LO A676, LY A676, LW A676 LS A679, LY A679, LG A679 - Hyper Micro SIDELED® LS Y876, LA Y876, LO Y876, LY Y876 LT Y87S - SmartLED LW L88C, LW L88S LB L89C, LB L89S, LG L890 LS L89K, LO L89K, LY L89K LS L896, LA L896, LO L896, LY L896 - TOPLED LS T670, LO T670, LY T670, LG T670, LP T670 LSG T670, LSP T670, LSY T670, LOP T670, LYG T670 LG T671, LOG T671, LSG T671 LB T673, LV T673, LT T673, LW T673 LH T674 LS T676, LA T676, LO T676, LY T676, LB T676, LH T676, LSB T676, LW T676 LB T67C, LV T67C, LT T67C, LS T67K, LO T67K, LY T67K, LW E67C LS E67B, LA E67B, LO E67B, LY E67B, LB E67C, LV E67C, LT E67C LW T67C LS T679, LY T679, LG T679 LS T770, LO T770, LY T770, LG T770, LP T770 LB T773, LV T773, LT T773, LW T773 LH T774 LS E675, LA E675, LY E675, LS T675 LS T776, LA T776, LO T776, LY T776, LB T776 LHGB T686 LT T68C, LB T68C - Hyper Mini TOPLED® LB M676 - Mini TOPLED Santana® LG M470 LS M47K, LO M47K, LY M47K Source: http://www.osram.convergy.de LUXEON: - LUMILED® LXK2-PW12-R00, LXK2-PW12-S00, LXK2-PW14-U00, LXK2-PW14-V00 LXK2-PM12-R00, LXK2-PM12-S00, LXK2-PM14-U00 LXK2-PE12-Q00, LXK2-PE12-R00, LXK2-PE12-S00, LXK2-PE14-T00, LXK2-PE14-U00 LXK2-PB12-K00, LXK2-PB12-L00, LXK2-PB12-M00, LXK2-PB14-N00, LXK2-PB14-P00, LXK2-PB14-Q00 LXK2-PR12-L00, LXK2-PR12-M00, LXK2-PR14-Q00, LXK2-PR14-R00 LXK2-PD12-Q00, LXK2-PD12-R00, LXK2-PD12-S00 LXK2-PH12-R00, LXK2-PH12-S00 LXK2-PL12-P00, LXK2-PL12-Q00, LXK2-PL12-R00 Source: www.luxeon.com KINGBRIGHT: KA-3528ASYC Source: www.kingbright.com; SPICEPREFIX: L
M1 = IMST:IM-X8X: The iM881Ais a compact, low power, bidirectional radio module for the 868MHz frequency bandusing Semtech’s LoRaTMmodulation technology. The module provides ultra-long range spread spectrumcommunication and high interference immunity whilstminimising current consumption. Using the iM881Ain an application minimizes the need for an expensive and time-consuming RF development. Fast time to market is possible with this pre-qualified module.The iM881Aprovides an optimized RF performance for the extreme temperature range In addition, the iM881Ais optimized for battery driven application and is equipped with apowerful STM32L051 controller.
PAD1-PAD4 = wirepad:SMD2: SMD PAD
Q1 = special:XTAL/S: CRYSTAL
R1-R8 R10-R14 R16 R18-R23 R25 R27 R31 R32 R38 R43 R44 R47 R50 R51 R54 R55 R63-R67 R76 R78-R81 R84 R91 R106 R120-R122 = rcl:R-EU_: RESISTOR, European symbol
R9 R15 R17 R24 R26 R28 R30 R33-R37 R39 R53 R60 R68 R69 R73 R75 R77 R85 R86 R88 = rcl:R-EU_: RESISTOR, European symbol; SPICEPREFIX: R
R56 R82 = monitoring_board:R-TRIMM: Trimm resistor
S1 = SparkFun-Switches:MOMENTARY-SWITCH-SPST: Momentary Switch (Pushbutton) - SPST Normally-open (NO) SPST momentary switches (buttons, pushbuttons). Variants PTH-12MM - 12mm square, through-hole Momentary Pushbutton Switch - 12mm Square <https://www.sparkfun.com/products/9190> (COM-09190) PTH-6.0MM, PTH-6.0MM-KIT - 6.0mm square, through-hole Mini Pushbutton Switch <https://www.sparkfun.com/products/97> (COM-00097) KIT package intended for soldering kit's - only one side of pads' copper is exposed. PTH-RIGHT-ANGLE-KIT - Right-angle, through-hole Right Angle Tactile Button <https://www.sparkfun.com/products/10791> - Used on SparkFun BigTime Watch Kit <https://www.sparkfun.com/products/11734> SMD-12MM - 12mm square, surface-mount Tactile Button - SMD (12mm) <https://www.sparkfun.com/products/12993> (COM-12993) Used on SparkFun PicoBoard <https://www.sparkfun.com/products/11888> SMD-4.5MM - 4.5mm Square Trackball Switch Used on SparkFun Blackberry Trackballer Breakout <https://www.sparkfun.com/products/13169> SMD-4.6MMX2.8MM - 4.60mm x 2.80mm, surface mount Used on SparkFun SAMD21 Mini Breakout <https://www.sparkfun.com/products/13664> SMD-5.2MM, SMD-5.2-REDUNDANT - 5.2mm square, surface-mount Mini Pushbutton Switch - SMD <https://www.sparkfun.com/products/8720> (COM-08720) Used on Arduino Pro Mini <https://www.sparkfun.com/products/11114> REDUNDANT package connects both switch circuits together SMD-6.0X3.5MM - 6.0 x 3.5mm, surface mount Momentary Reset Switch SMD <https://www.sparkfun.com/products/8229> (COM-08229) SMD-6.2MM-TALL - 6.2mm square, surface mount Tactile Button - SMD (6mm) <https://www.sparkfun.com/products/12992> Used on SparkFun Digital Sandbox <https://www.sparkfun.com/products/12651> SMD-RIGHT-ANGLE - Right-angle, surface mount Used on SparkFun Block for Intel® Edison - Arduino <https://www.sparkfun.com/products/13036>; PROD_ID: SWCH-00815; SF_SKU: COM-08229
SJ1 SJ2 = jumper:SJ: SMD solder JUMPER
T1 = monitoring_board:SI7157DP: Vishay Siliconix - Si157DP -- P-Channel 20V (D-S) MOSFET; SPICEPREFIX: J
T2 T15-T24 = monitoring_board:SI7157DP: Vishay Siliconix - Si157DP -- P-Channel 20V (D-S) MOSFET
TP1 TP2 = testpad:PTR1: TEST PIN
U$1 = monitoring_board:TSR-1-XXXX: Non-Isolated DC/DC Converter (POL) by Traco Power - TSR 1-2433
U$2 U$34 U$35 U$37-U$41 = monitoring_board:NXP_BC847: NXP -- BC847 -- NPN General Purpose Transistors 45V; 100mA
U$4-U$6 U$8 U$18 U$19 U$22 U$23 = monitoring_board:REF31XX-Q1: Texas Instruments REF31xx-Q1 15ppm/°C Maximum, 100-mikroA, SOT-23 Series Voltage Reference Models: REF3112-Q1 -- 1.25V REF3120-Q1 -- 2.048V REF3125-Q1 -- 2.5V REF3130-Q1 -- 3V REF3133-Q1 -- 3.3V REF3140-Q1 -- 4.096V
U$9 = monitoring_board:NXP_BC857: NXP - BC856; BC857; BC858 -- PNP General Purpose Transistors 65V; 100mA
U$10 U$16 U$17 U$20 U$21 U$24-U$26 = monitoring_board:MCP33131-05: Microchip -- MCP33131/21/11-XX -- 1Msps/500kSPS 16/14/12-Bit Single-Ended Input SAR ADC Modell: MCP33131-05 -- 500kSPS 16-Bit
U$11 = monitoring_board:DLP11SN900HL2: Murata (R) Chip Common Mode Choke Coil DLP11SNxxxxL2x-Series Modell: DLP11SN900HL2 Source: https://www.murata.com/en-us/products/productdata/8796756344862/EFLE0004.pdf Source: https://www.murata.com/~/media/webrenewal/support/library/catalog/products/emc/emifil/c35e.ashx
U$12 U$13 = monitoring_board:BLM21PG221SN1: Murata (R) Chip Ferrite Bead -- BLM21xxxxxxSNx-Series Modell: BLM21PG221SN1 Source: https://www.murata.com/en-us/products/en-us/products/productdata/8796738977822/ENFA0005.pdf Source: https://www.murata.com/~/media/webrenewal/support/library/catalog/products/emc/emifil/c35e.ashx
U$14 = monitoring_board:DUP2201MR6: ON Semiconductor (R) -- ESD Protection Diode -- Low Clamping Voltage TSOP-6 Low Capacitance Diode Surge Protection array 550 watts peak power 6 volts Modell: NUP2201MR6 Source: https://www.onsemi.com/pub/Collateral/NUP2201MR6-D.PDF
U$27-U$29 = monitoring_board:INA138: Texas Instruments -- INA1x8 High-Side Measurement Current Shunt Monitor Modell: INA139 Input common-mode and pwoer-supply voltages are independent and can range from 2.7V to 36V for the INA 138
U$36 = monitoring_board:BQ24650: Texas Instruments -- bq24650 Synchronous Switch-Mode Battery Charge Controller for Solar Power With Maximum Power Point Tracking
U$42 U$47 = monitoring_board:SIR404DP: Vishay Siliconix SiR404DP -- N-Channel 20V (D-S) MOSFET
U$45 = monitoring_board:IHLP-2525CZ-01: Vishay Dale -- IHLP-2525CZ-01 IHLP® Commercial Inductors, High Saturation Series; SPICEPREFIX: B
U$46 = monitoring_board:2N7002: 2N7002E -- Vishay Siliconix N-Channel MOSFET, 60-V, 115-mA, SOT-23, 2N7002DICT
U$48 = monitoring_board:BAT54C: Diode, Dual Schottky, 30-V, 200-mA, SOT-23, Fairchild, BAT54C
U$49 = monitoring_board:PDS1040: Diode, Schottky Rectifier, 40-V, 10-A, PDS1040
X1 = con-coax:SMA-: SMA 50 Ohm End Launch Jack Receptacle - Round Contact Johnson Components Source: www.johnsoncomponents.com .. J502-ND.pdf; MF: JOHNSON COMPONENTS; MPN: 142-0701-801; OC_FARNELL: 1608592; OC_NEWARK: 90F2624
X2 = con-berg:PN61729-S: BERG USB connector; OC_FARNELL: unknown; OC_NEWARK: unknown

## Net classes
1 ant: width 0.8 mm, clearance 0.1 mm